# EasyEDA Pro project ProPrj_ADC前级驱动电路_2025-07-17.epro

# Schematic Schematic1
Board Name: Board1; Create Date: 2025-07-17; Page Name: P1; Project Name: ADC前级驱动电路; Schematic Name: Schematic1; Update Date: 2025-07-17; Company: 嘉立创EDA; Page Size: A4; Version: V1.0
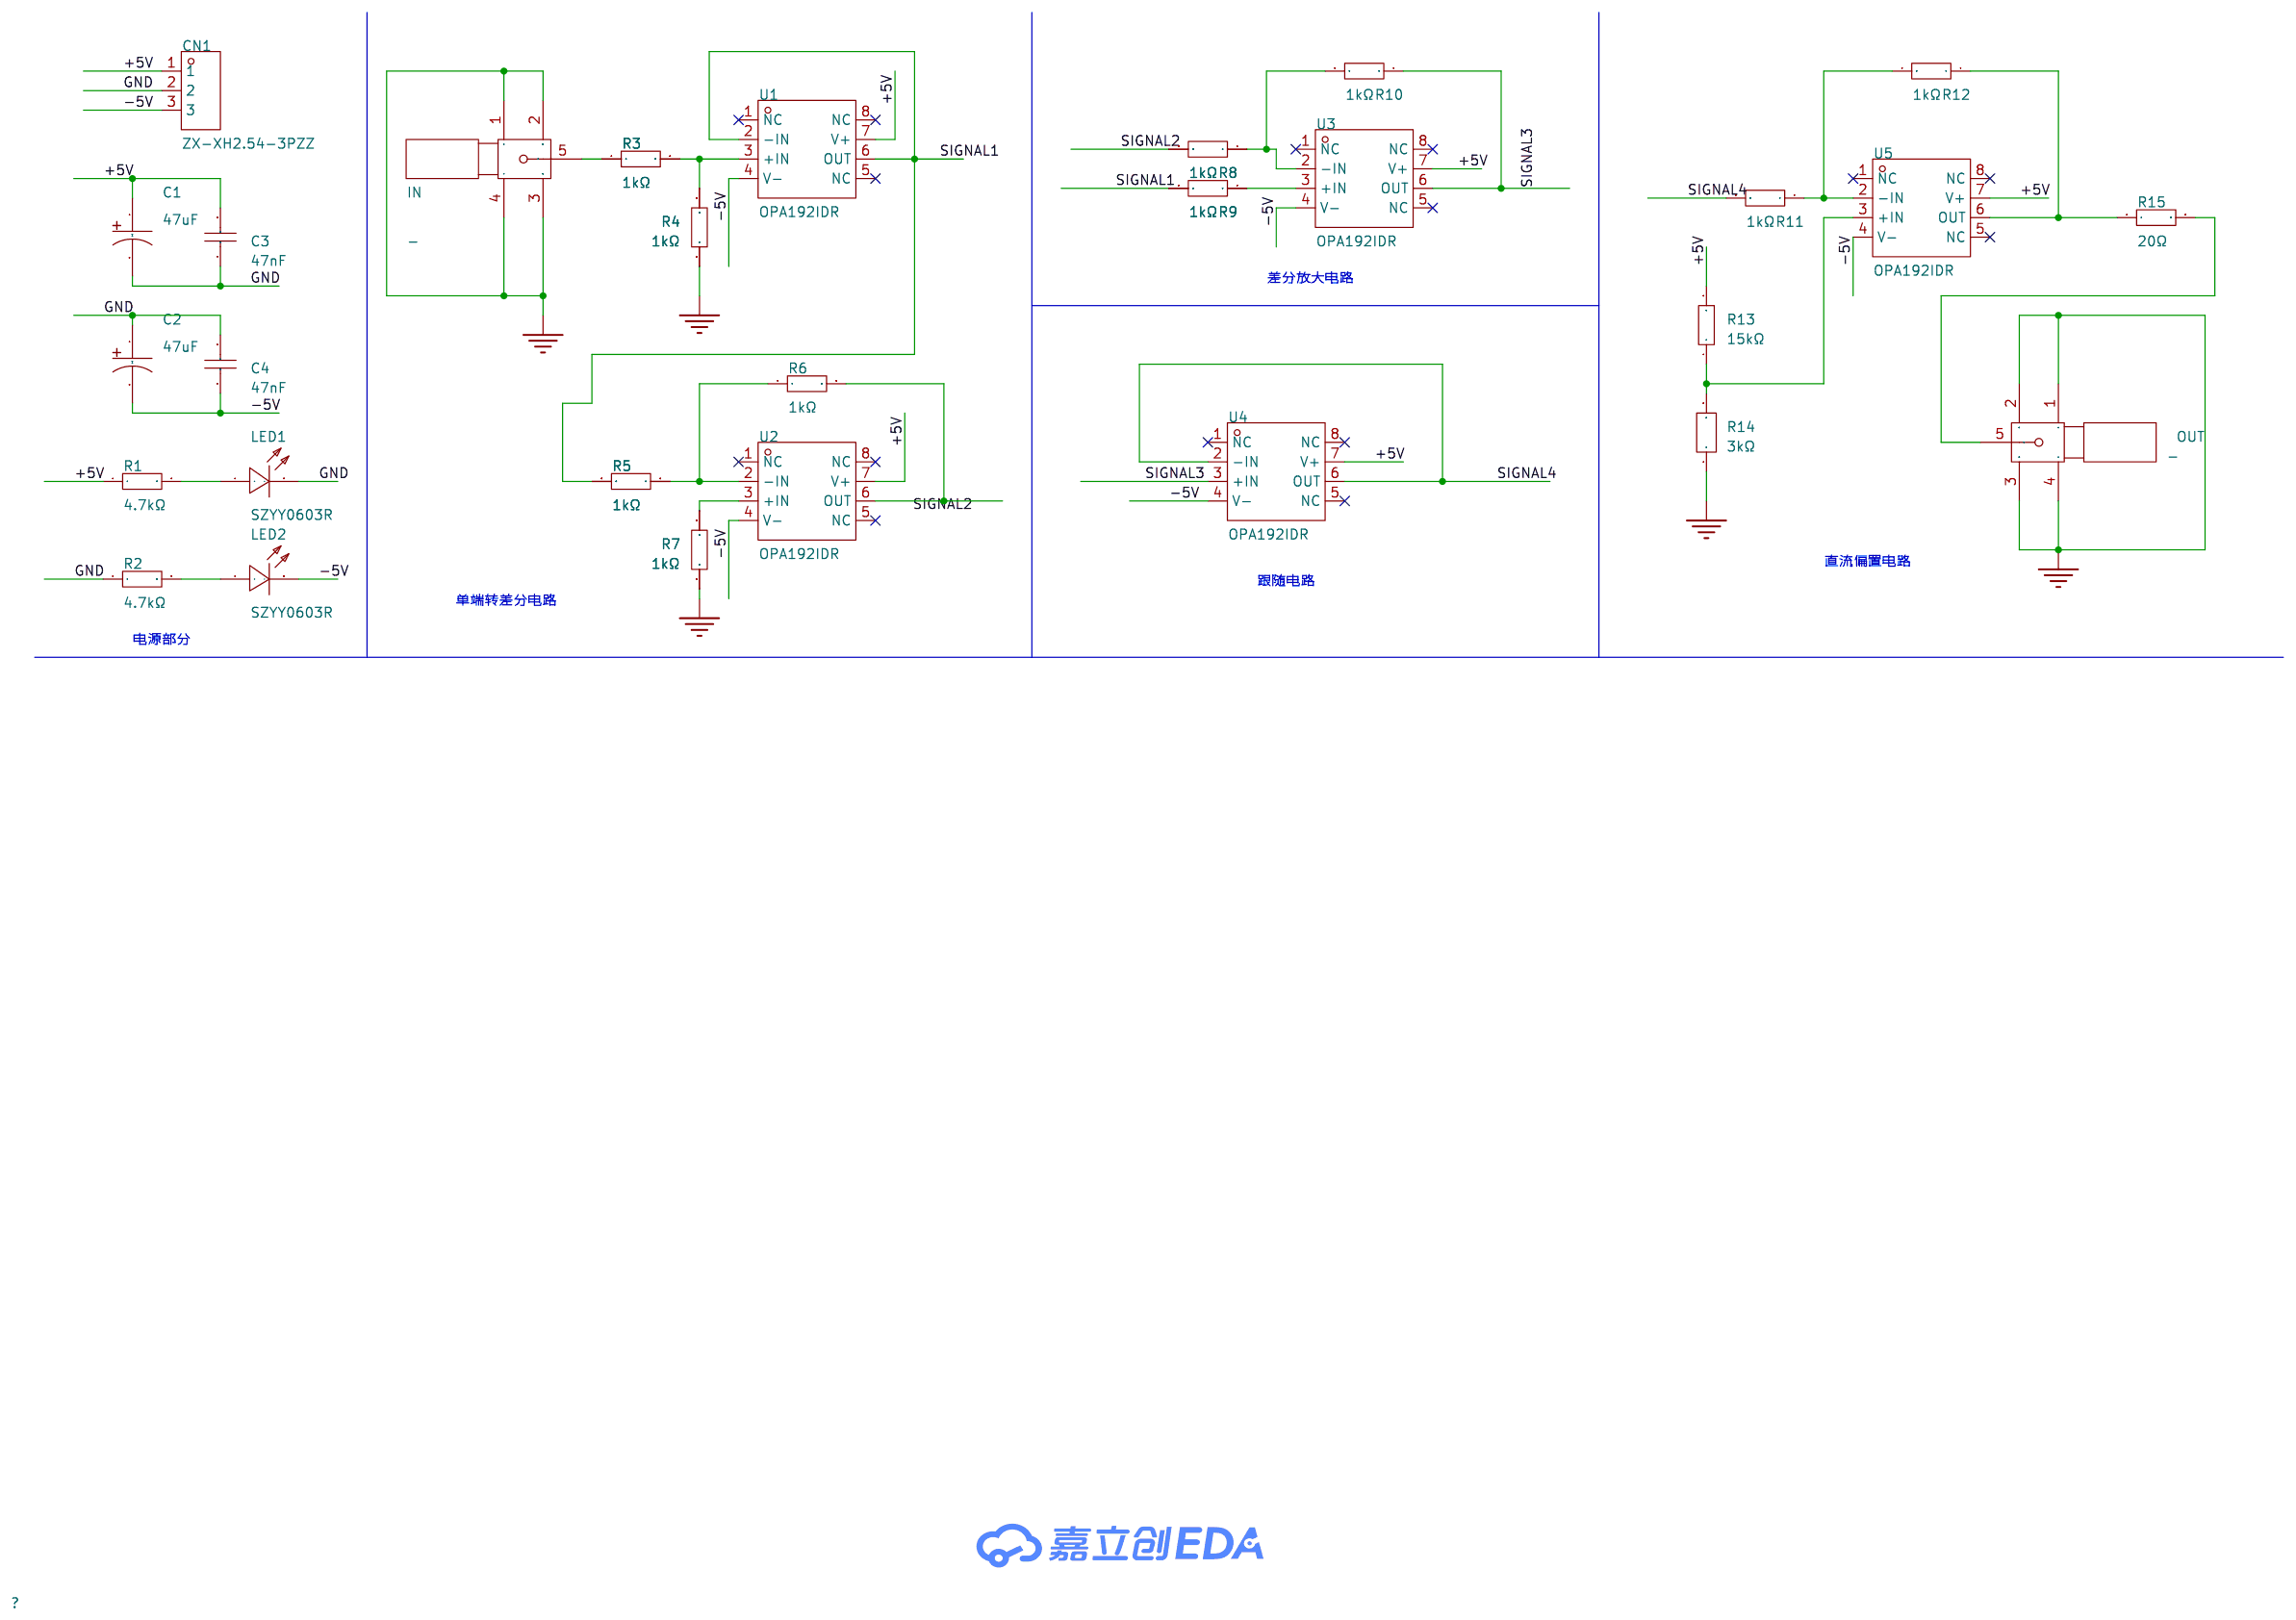
[diagram p0: schematic sheet]

## Parts
C1  47uF  [CAP-TH_BD5.0-P2.00-D0.8-FD]
C2  47uF  [CAP-TH_BD5.0-P2.00-D0.8-FD]
C3  47nF  [C0805]
C4  47nF  [C0805]
CN1  ZX-XH2.54-3PZZ  [CONN-TH_3P-P2.54_2501S-3P]
IN  -  [SMA-SMD_BWSMA-KE-P001]
LED1  SZYY0603R  [LED0603-R-RD]
LED2  SZYY0603R  [LED0603-R-RD]
OUT  -  [SMA-SMD_BWSMA-KE-P001]
R1  4.7kΩ  [R0805]
R2  4.7kΩ  [R0805]
R3  1kΩ  [R0805]
R4  1kΩ  [R0805]
R5  1kΩ  [R0805]
R6  1kΩ  [R0805]
R7  1kΩ  [R0805]
R8  1kΩ  [R0805]
R9  1kΩ  [R0805]
R10  1kΩ  [R0805]
R11  1kΩ  [R0805]
R12  1kΩ  [R0805]
R13  15kΩ  [R0805]
R14  3kΩ  [R0805]
R15  20Ω  [R0805]
U1  OPA192IDR  [SOIC-8_L4.9-W3.9-P1.27-LS6.0-BL]
U2  OPA192IDR  [SOIC-8_L4.9-W3.9-P1.27-LS6.0-BL]
U3  OPA192IDR  [SOIC-8_L4.9-W3.9-P1.27-LS6.0-BL]
U4  OPA192IDR  [SOIC-8_L4.9-W3.9-P1.27-LS6.0-BL]
U5  OPA192IDR  [SOIC-8_L4.9-W3.9-P1.27-LS6.0-BL]

## Library data of the parts
C1 C2 = NXB25V47M5*11 2.5TP: 容值:47uF;精度:±20%;额定电压:25V;纹波电流:250mA@100kHz;等效串联电阻(ESR):300mΩ@100kHz;; LCSC Part Name: 47uF ±20% 25V; Supplier Part: C371230; Manufacturer: SAMYOUNG(韩国三莹); Supplier Footprint: 插件,D5xL11mm; JLCPCB Part Class: 扩展库; Datasheet: https://atta.szlcsc.com/upload/public/pdf/source/20190227/C371244_FA85FFEFC2961227CF12E3CCE8C34A7D.pdf; Supplier: LCSC; Tolerance: ±20%; Voltage Rating: 25V; Ripple Current: 250mA@100kHz; Equivalent Series Resistance(ESR): 300mΩ@100kHz; Pin Spacing: 2mm; Diameter: 5mm; Height - Seated (Max): 11mm; Lifetime: 2000hrs@105℃; Operating Temperature: -40℃~+105℃
C3 C4 = CL21B473KBCNNNC: 容值:47nF;精度:±10%;额定电压:50V;材质(温度系数):X7R;; LCSC Part Name: 47nF ±10% 50V; Supplier Part: C53134; Manufacturer: SAMSUNG(三星); Supplier Footprint: 0805; JLCPCB Part Class: 基础库; Datasheet: https://atta.szlcsc.com/upload/public/pdf/source/20160218/1457707763339.pdf; Supplier: LCSC; Tolerance: ±10%; Voltage Rated: 50V; Temperature Coefficient: X7R
CN1 = ZX-XH2.54-3PZZ: 插针结构:1x3P;间距:2.5mm;安装方式:直插;参考系列:XH;总PIN数:3P;排数:1;每排PIN数:3;行距:-;额定电流:3A;触头材质:黄铜;触头镀层:锡;工作温度范围:-25℃~+85℃;; LCSC Part Name: 1x3P 间距:2.5mm 直插 系列:XH; Supplier Part: C7429633; Manufacturer: Megastar(兆星); Supplier Footprint: 插件,P=2.5mm; JLCPCB Part Class: 扩展库; Datasheet: https://atta.szlcsc.com/upload/public/pdf/source/20230619/AE17037A2CFDBE8D9CBA775D61AD0A84.pdf; Supplier: LCSC; Pins Structure: 1x3P; Pitch: 2.5mm; Mounting Type: 直插; Reference Series: XH; Number of Pins: 3P; Number of Rows: 1; Number of PINs Per Row: 3; Rated Current: 3A; Contact Material: 黄铜; Contact Plating: 锡; Operating Temperature: -25℃~+85℃; Rated Voltage (Max): 250V; Plastic Material: PA66; Flame Retardant Rating: UL94V-0; Color: 白色; Z-Height of the Board: 7mm; X-Length of Bottom Edge on Board (Spacing Line): 10mm; Y-Width of Bottom Edge on Board: 5.9mm
IN OUT = BWSMA-KE-P001: 连接器类型:板端;接口类型:内孔;端口数量:1;接口直径:5.2mm;接口长度/高度:-;频率:-;射频系列:SMA;阻抗:50Ω;样式:偏脚;工作温度:-;; LCSC Part Name: 内孔 SMA 偏脚; Supplier Part: C496550; Manufacturer: BAT WIRELESS(蝙蝠无线); Supplier Footprint: SMD; JLCPCB Part Class: 扩展库; Datasheet: https://atta.szlcsc.com/upload/public/pdf/source/20240320/28FD502871C976DFF213ABFCF2A0ED51.pdf; Supplier: LCSC; Connector Type: 板端; Interface: 内孔; Number of Ports: 1; Interface Diameter: 5.2mm; RF Series: SMA; Impedance: 50Ω; Style: 偏脚
LED1 LED2 = SZYY0603R: 发光颜色:红色;功率:40mW;正向电流:20mA;主波长:615nm~630nm;二极管配置:-;透镜颜色:无色透明透镜;色温:-;发光角度:120°;载带方式:-;工作温度:-40℃~+85℃;; LCSC Part Name: 红灯; Supplier Part: C434419; Manufacturer: yongyu(永裕光电); Supplier Footprint: 0603; JLCPCB Part Class: 扩展库; Datasheet: https://atta.szlcsc.com/upload/public/pdf/source/20191204/C434419_0B955C1F73FF88449D9A795B6FF49070.pdf; Supplier: LCSC; Emitted Color: 红色; Power Dissipation: 40mW; Forward Current: 20mA; Dominant Wavelength: 615nm~630nm; Peak Wavelength: 645nm; Lens Color: 无色透明透镜; Viewing Angle: 120°; Operating Temperature: -40℃~+85℃
R1 R2 = 0805W8F4701T5E: 电阻类型:厚膜电阻;阻值:4.7kΩ;精度:±1%;功率:125mW;最大工作电压:150V;温度系数:±100ppm/℃;; LCSC Part Name: 4.7kΩ ±1% 125mW 厚膜电阻; Supplier Part: C17673; Manufacturer: UNI-ROYAL(厚声); Supplier Footprint: 0805; JLCPCB Part Class: 基础库; Datasheet: https://atta.szlcsc.com/upload/public/pdf/source/20200306/C422600_1E6D84923E4A46A82E41ADD87F860B5C.pdf; Supplier: LCSC; Type: 厚膜电阻; Tolerance: ±1%; Power(Watts): 125mW; Overload Voltage (Max): 150V; Temperature Coefficient: ±100ppm/℃; Operating Temperature Range: -55℃~+155℃
R3-R12 = 0805W8F1001T5E: 电阻类型:厚膜电阻;阻值:1kΩ;精度:±1%;功率:125mW;最大工作电压:150V;温度系数:±100ppm/℃;; LCSC Part Name: 1kΩ ±1% 125mW 厚膜电阻; Supplier Part: C17513; Manufacturer: UNI-ROYAL(厚声); Supplier Footprint: 0805; JLCPCB Part Class: 基础库; Datasheet: https://atta.szlcsc.com/upload/public/pdf/source/20200306/C422600_1E6D84923E4A46A82E41ADD87F860B5C.pdf; Supplier: LCSC; Type: 厚膜电阻; Tolerance: ±1%; Power(Watts): 125mW; Overload Voltage (Max): 150V; Temperature Coefficient: ±100ppm/℃; Operating Temperature Range: -55℃~+155℃
R13 = 0805W8F1502T5E: 电阻类型:厚膜电阻;阻值:15kΩ;精度:±1%;功率:125mW;最大工作电压:150V;温度系数:±100ppm/℃;; LCSC Part Name: 15kΩ ±1% 125mW 厚膜电阻; Supplier Part: C17475; Manufacturer: UNI-ROYAL(厚声); Supplier Footprint: 0805; JLCPCB Part Class: 基础库; Datasheet: https://atta.szlcsc.com/upload/public/pdf/source/20200306/C422600_1E6D84923E4A46A82E41ADD87F860B5C.pdf; Supplier: LCSC; Type: 厚膜电阻; Tolerance: ±1%; Power(Watts): 125mW; Overload Voltage (Max): 150V; Temperature Coefficient: ±100ppm/℃; Operating Temperature Range: -55℃~+155℃
R14 = FRC0805J302 TS: 电阻类型:厚膜电阻;阻值:3kΩ;精度:±5%;功率:125mW;最大工作电压:150V;温度系数:±100ppm/℃;; LCSC Part Name: 3kΩ ±5% 125mW 厚膜电阻; Supplier Part: C2907324; Manufacturer: FOJAN(富捷); Supplier Footprint: 0805; JLCPCB Part Class: 扩展库; Datasheet: https://atta.szlcsc.com/upload/public/pdf/source/20211221/925EC7D7225764EE0046F22065062C87.pdf; Supplier: LCSC; Type: 厚膜电阻; Tolerance: ±5%; Power(Watts): 125mW; Overload Voltage (Max): 150V; Temperature Coefficient: ±100ppm/℃; Operating Temperature Range: -55℃~+155℃
R15 = 0805W8F200JT5E: 电阻类型:厚膜电阻;阻值:20Ω;精度:±1%;功率:125mW;最大工作电压:150V;温度系数:±200ppm/℃;; LCSC Part Name: 20Ω ±1% 125mW 厚膜电阻; Supplier Part: C17544; Manufacturer: UNI-ROYAL(厚声); Supplier Footprint: 0805; JLCPCB Part Class: 基础库; Datasheet: https://atta.szlcsc.com/upload/public/pdf/source/20200306/C422600_1E6D84923E4A46A82E41ADD87F860B5C.pdf; Supplier: LCSC; Type: 厚膜电阻; Tolerance: ±1%; Power(Watts): 125mW; Overload Voltage (Max): 150V; Temperature Coefficient: ±200ppm/℃; Operating Temperature Range: -55℃~+155℃
U1-U5 = OPA192IDR: 放大器数:单路;增益带宽积(GBP):10MHz;输入偏置电流(Ib):5pA;输入失调电压(Vos):5uV;压摆率(SR):20V/us;轨到轨:轨到轨输入,轨到轨输出;; Supplier Part: C2861286; Manufacturer: TI(德州仪器); Supplier Footprint: SOIC-8; JLCPCB Part Class: 扩展库; Datasheet: https://www.ti.com/cn/lit/gpn/opa4192; Supplier: LCSC; Number of Channels: 单路; Gain Bandwidth Product: 10MHz; Ib - Input Bias Current: 5pA; Vos - Input Offset Voltage: 5uV; Common Mode Rejection Ratio(CMRR): 140dB; Slew Rate: 20V/us; Output Current: 65mA; Rail to Rail: 轨到轨输入,轨到轨输出; Input Offset Voltage Drift(Vos TC): 200nV/℃; Quiescent Current(Iq): 1mA; Operating Temperature: -40℃~+125℃; Single Supply: 4.5V~36V; Dual Supply: -18V~-2.25V；2.25V~18V; Maximum Power Supply Range (Vdd-Vss): 36V; Noise density(eN): 5.5nV/√Hz@1kHz; Input Offset Current(Ios): 2pA

## Nets
+5V: C1.1 C3.2 CN1.1 R1.1 R13.2 U1.7(V+) U2.7(V+) U3.7(V+) U4.7(V+) U5.7(V+)
-5V: C2.2 C4.1 CN1.3 LED2.2(-) U1.4(V-) U2.4(V-) U3.4(V-) U4.4(V-) U5.4(V-)
GND: C1.2 C2.1 C3.1 C4.2 CN1.2 IN.1 IN.2 IN.3 IN.4 LED1.2(-) OUT.1 OUT.2 OUT.3 OUT.4 R2.1 R4.1 R7.1 R14.1
SIGNAL1: R5.2 R9.2 U1.2(-IN) U1.6(OUT)
SIGNAL2: R6.2 R8.2 U2.6(OUT)
SIGNAL3: R10.1 U3.6(OUT) U4.3(+IN)
SIGNAL4: R11.2 U4.2(-IN) U4.6(OUT)
$1N2910: IN.5 R3.1
$1N2927: LED1.1(+) R1.2
$1N2936: LED2.1(+) R2.2
$1N3121: R3.2 R4.2 U1.3(+IN)
$1N3311: R7.2 U2.3(+IN)
$1N3355: R5.1 R6.1 U2.2(-IN)
$1N3535: R8.1 R10.2 U3.2(-IN)
$1N3541: R9.1 U3.3(+IN)
$1N3767: R11.1 R12.2 U5.2(-IN)
$1N3921: R13.1 R14.2 U5.3(+IN)
$1N4048: OUT.5 R15.2
$1N4065: R12.1 R15.1 U5.6(OUT)

Not connected (* = marked no-connect by the designer): U1 1(NC)* 5(NC)* 8(NC)*; U2 1(NC)* 5(NC)* 8(NC)*; U3 1(NC)* 5(NC)* 8(NC)*; U4 1(NC)* 5(NC)* 8(NC)*; U5 1(NC)* 5(NC)* 8(NC)*

## Notes on the sheet
- 差分放大电路
- 直流偏置电路
- 跟随电路
- 单端转差分电路
- 电源部分

# Board PCB1
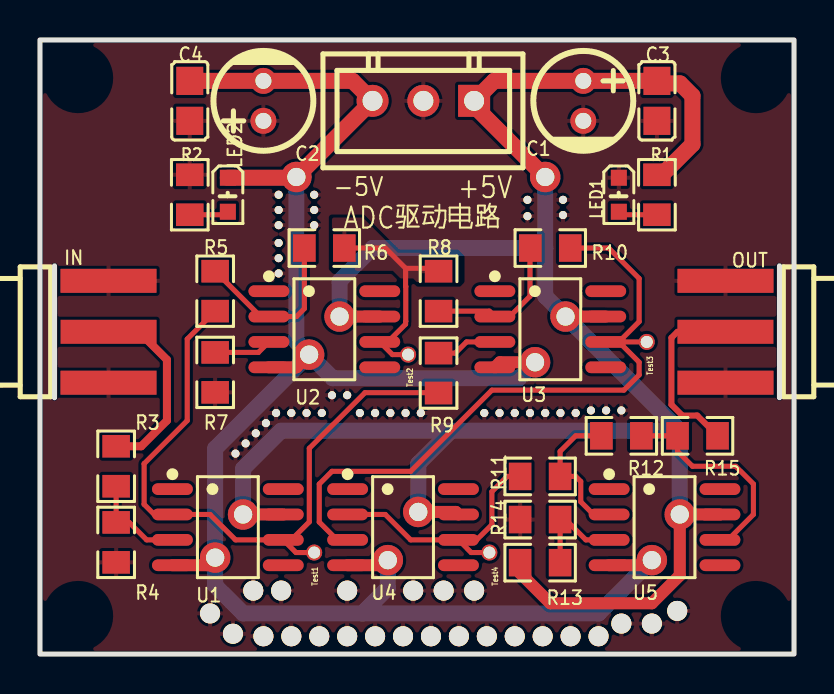
[diagram p1: board, top side]
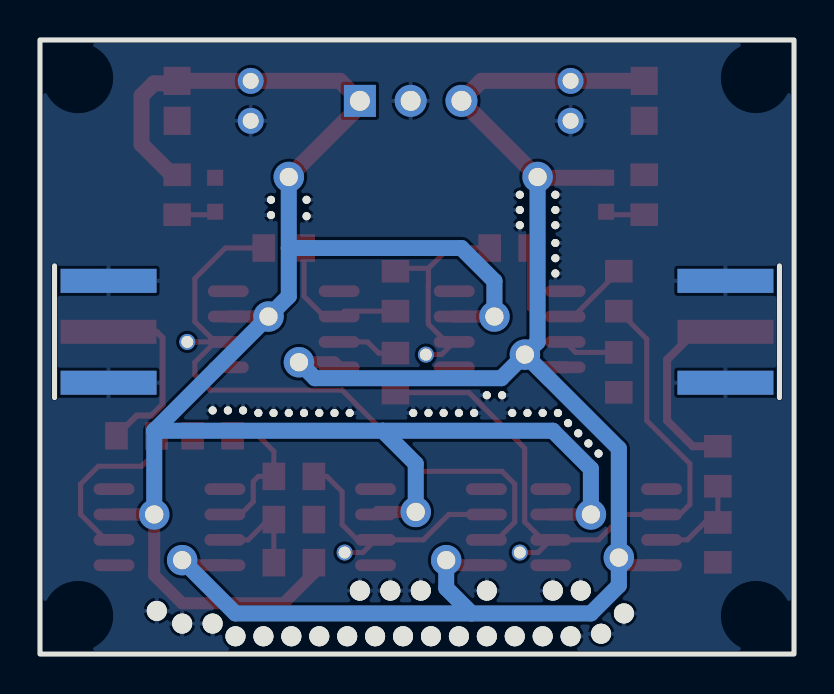
[diagram p2: board, bottom side, seen from below]

Outline 37.72 x 30.73 mm; copper layers: Top Layer, Bottom Layer. Coordinates in mm from the lower left corner of the outline.
Outline path: rectangle 0,30.73 37.72,0
Stack: Top Layer 0.035mm / Dielectric1 1.51mm FR4 er 4.5 / Bottom Layer 0.035mm

## Design rules (mm)
template: JLCPCB Capability(Two Layers Board)
spacing copperThickness1oz (default): track to track 0.102, other pairs 0.152 to 0.3
spacing copperThickness2oz: track to track 0.203, other pairs 0.152 to 0.3
track width copperThickness1oz (default): min 0.127, default 0.254, max 2.54
track width copperThickness2oz: min 0.203, default 0.254, max 2.54
differential pair differentialPair (default): width min 0.127, default 0.254, max 2.54; gap min 0.152, default 0.152
via viaSize (default): diameter min 0.5, default 0.61, max 10; hole min 0.3, default 0.305, max 6.3

## Placement (name value [footprint] x y rotation side)
-5V  ZX-XH2.54-3PZZ  [CONN-TH_3P-P2.54_2501S-3P]  19.18 27.69 180 top
C1  47uF  [CAP-TH_BD5.0-P2.00-D0.8-FD]  27.18 27.69 270 top
C2  47uF  [CAP-TH_BD5.0-P2.00-D0.8-FD]  11.18 27.69 90 top
C3  47nF  [C0805]  30.86 27.69 90 top
C4  47nF  [C0805]  7.49 27.69 270 top
IN  -  [SMA-SMD_BWSMA-KE-P001]  3.43 16.13 180 top
LED1  SZYY0603R  [LED0603-R-RD]  28.96 22.99 270 top
LED2  SZYY0603R  [LED0603-R-RD]  9.4 22.99 270 top
NOREF  -  [Pad_e364]  13.34 12.06 0 top
NOREF#2  -  [Pad_e334]  18.16 0.89 0 top
NOREF#3  -  [Pad_e393]  24.38 22.73 0 top
NOREF#4  -  [Pad_e342]  29.08 1.52 0 top
NOREF#5  -  [Pad_e389]  11.94 21.46 0 top
NOREF#6  -  [Pad_e336]  20.95 0.89 0 top
NOREF#7  -  [Pad_e351]  21.72 3.17 0 top
NOREF#8  -  [Pad_e273]  26.29 16.89 0 top
NOREF#9  -  [Pad_e60]  25.27 23.88 0 top
NOREF#10  -  [Pad_e357]  9.78 10.03 0 top
NOREF#11  -  [Pad_e360]  10.79 11.05 0 top
NOREF#12  -  [Pad_e397]  18.41 14.99 0 top
NOREF#13  -  [Pad_e333]  16.76 0.89 0 top
NOREF#14  -  [Pad_e335]  19.56 0.89 0 top
NOREF#15  -  [Pad_e330]  12.57 0.89 0 top
NOREF#16  -  [Pad_e376]  23.75 12.06 0 top
NOREF#17  -  [Pad_e340]  26.54 0.89 0 top
NOREF#18  -  [Pad_e329]  11.18 0.89 0 top
NOREF#19  -  [Pad_e394]  24.38 21.91 0 top
NOREF#20  -  [Pad_e346]  12.06 3.17 0 top
NOREF#21  -  [Pad_e341]  27.94 0.89 0 top
NOREF#22  -  [Pad_e298]  10.16 6.98 0 top
NOREF#23  -  [Pad_e377]  24.51 12.06 0 top
NOREF#24  -  [Pad_e339]  25.15 0.89 0 top
NOREF#25  -  [Pad_e392]  11.94 19.05 0 top
NOREF#26  -  [Pad_e387]  11.94 22.99 0 top
NOREF#27  -  [Pad_e246]  17.4 4.7 0 top
NOREF#28  -  [Pad_e383]  29.08 12.19 0 top
NOREF#29  -  [Pad_e41]  12.83 23.88 0 top
NOREF#30  -  [Pad_e386]  13.72 21.46 0 top
NOREF#31  -  [Pad_e264]  30.61 4.7 0 top
NOREF#32  -  [Pad_e380]  26.8 12.06 0 top
NOREF#33  -  [Pad_e388]  11.94 22.22 0 top
NOREF#34  -  [Pad_e227]  8.76 4.83 0 top
NOREF#35  -  [Pad_e396]  26.16 21.97 0 top
NOREF#36  -  [Pad_e337]  22.35 0.89 0 top
NOREF#37  -  [Pad_e359]  10.29 10.54 0 top
NOREF#38  -  [Pad_e390]  11.94 20.57 0 top
NOREF#39  -  [Pad_e222]  13.46 14.99 0 top
NOREF#40  -  [Pad_e362]  11.81 12.06 0 top
NOREF#41  -  [Pad_e366]  14.6 12.95 0 top
NOREF#42  -  [Pad_e413]  22.48 5.08 0 top
NOREF#43  -  [Pad_e361]  11.3 11.56 0 top
NOREF#44  -  [Pad_e395]  26.16 22.73 0 top
NOREF#45  -  [Pad_e363]  12.57 12.06 0 top
NOREF#46  -  [Pad_e375]  22.99 12.06 0 top
NOREF#47  -  [Pad_e414]  30.35 15.62 0 top
NOREF#48  -  [Pad_e372]  19.05 12.06 0 top
NOREF#49  -  [Pad_e412]  13.72 5.08 0 top
NOREF#50  -  [Pad_e378]  25.27 12.06 0 top
NOREF#51  -  [Pad_e343]  30.61 1.52 0 top
NOREF#52  -  [Pad_e331]  13.97 0.89 0 top
NOREF#53  -  [Pad_e365]  14.1 12.06 0 top
NOREF#54  -  [Pad_e349]  18.67 3.17 0 top
NOREF#55  -  [Pad_e391]  11.94 19.81 0 top
NOREF#56  -  [Pad_e381]  27.56 12.19 0 top
NOREF#57  -  [Pad_e345]  10.67 3.17 0 top
NOREF#58  -  [Pad_e385]  13.72 22.22 0 top
NOREF#59  -  [Pad_e241]  14.99 16.89 0 top
NOREF#60  -  [Pad_e338]  23.75 0.89 0 top
NOREF#61  -  [Pad_e369]  16.76 12.06 0 top
NOREF#62  -  [Pad_e344]  31.88 2.16 0 top
NOREF#63  -  [Pad_e370]  17.53 12.06 0 top
NOREF#64  -  [Pad_e384]  13.72 22.99 0 top
NOREF#65  -  [Pad_e350]  20.19 3.17 0 top
NOREF#66  -  [Pad_e373]  22.22 12.06 0 top
NOREF#67  -  [Pad_e348]  15.37 3.17 0 top
NOREF#68  -  [Pad_e294]  18.92 7.11 0 top
NOREF#69  -  [Pad_e332]  15.37 0.89 0 top
NOREF#70  -  [Pad_e267]  24.76 14.6 0 top
NOREF#71  -  [Pad_e379]  26.03 12.06 0 top
NOREF#72  -  [Pad_e367]  15.37 12.95 0 top
NOREF#73  -  [Pad_e328]  9.65 1.02 0 top
NOREF#74  -  [Pad_e325]  8.51 2.03 0 top
NOREF#75  -  [Pad_e382]  28.32 12.19 0 top
NOREF#76  -  [Pad_e368]  16 12.06 0 top
NOREF#77  -  [Pad_e291]  32 6.98 0 top
NOREF#78  -  [Pad_e371]  18.29 12.06 0 top
OUT  -  [SMA-SMD_BWSMA-KE-P001]  34.29 16.13 0 top
R1  4.7kΩ  [R0805]  30.86 22.99 270 top
R2  4.7kΩ  [R0805]  7.49 22.99 270 top
R3  1kΩ  [R0805]  3.81 9.4 270 top
R4  1kΩ  [R0805]  3.81 5.59 90 top
R5  1kΩ  [R0805]  8.76 18.16 270 top
R6  1kΩ  [R0805]  14.22 20.32 0 top
R7  1kΩ  [R0805]  8.76 14.1 90 top
R8  1kΩ  [R0805]  19.94 18.16 90 top
R9  1kΩ  [R0805]  19.94 14.06 270 top
R10  1kΩ  [R0805]  25.53 20.32 180 top
R11  1kΩ  [R0805]  25.02 8.89 180 top
R12  1kΩ  [R0805]  29.08 10.92 180 top
R13  15kΩ  [R0805]  25.02 4.57 180 top
R14  3kΩ  [R0805]  25.02 6.73 0 top
R15  20Ω  [R0805]  32.89 10.92 0 top
U1  OPA192IDR  [SOIC-8_L4.9-W3.9-P1.27-LS6.0-BL]  9.4 6.35 270 top
U2  OPA192IDR  [SOIC-8_L4.9-W3.9-P1.27-LS6.0-BL]  14.22 16.26 270 top
U3  OPA192IDR  [SOIC-8_L4.9-W3.9-P1.27-LS6.0-BL]  25.53 16.26 270 top
U4  OPA192IDR  [SOIC-8_L4.9-W3.9-P1.27-LS6.0-BL]  18.16 6.35 270 top
U5  OPA192IDR  [SOIC-8_L4.9-W3.9-P1.27-LS6.0-BL]  31.24 6.35 270 top

## Footprints (pads in the part's own frame, mm; a bottom-side part is the same pattern mirrored in y, then rotated)
C0805
  rect 1.41x1.35 smd: 1(-1,0) 2(1,0)
CAP-TH_BD5.0-P2.00-D0.8-FD
  round 1.3 hole 0.8: 1(-1,0) 2(1,0)
CONN-TH_3P-P2.54_2501S-3P
  rect 1.6x1.6 hole 1: 1(-2.54,0)
  round 1.6 hole 1: 2(0,0) 3(2.54,0)
LED0603-R-RD
  rect 0.8x0.8 smd: 1(0.851,0) 2(-0.851,0)
Pad_e41
  round 1.524 hole 0.914: 1(0,0)
Pad_e60
  round 1.524 hole 0.914: 1(0,0)
Pad_e222
  round 1.524 hole 0.914: 1(0,0)
Pad_e227
  round 1.524 hole 0.914: 1(0,0)
Pad_e241
  round 1.524 hole 0.914: 1(0,0)
Pad_e246
  round 1.524 hole 0.914: 1(0,0)
Pad_e264
  round 1.524 hole 0.914: 1(0,0)
Pad_e267
  round 1.524 hole 0.914: 1(0,0)
Pad_e273
  round 1.524 hole 0.914: 1(0,0)
Pad_e291
  round 1.524 hole 0.914: 1(0,0)
Pad_e294
  round 1.524 hole 0.914: 1(0,0)
Pad_e298
  round 1.524 hole 0.914: 1(0,0)
Pad_e325
  round 1 hole 1: 1(0,0)
Pad_e328
  round 1 hole 1: 1(0,0)
Pad_e329
  round 1 hole 1: 1(0,0)
Pad_e330
  round 1 hole 1: 1(0,0)
Pad_e331
  round 1 hole 1: 1(0,0)
Pad_e332
  round 1 hole 1: 1(0,0)
Pad_e333
  round 1 hole 1: 1(0,0)
Pad_e334
  round 1 hole 1: 1(0,0)
Pad_e335
  round 1 hole 1: 1(0,0)
Pad_e336
  round 1 hole 1: 1(0,0)
Pad_e337
  round 1 hole 1: 1(0,0)
Pad_e338
  round 1 hole 1: 1(0,0)
Pad_e339
  round 1 hole 1: 1(0,0)
Pad_e340
  round 1 hole 1: 1(0,0)
Pad_e341
  round 1 hole 1: 1(0,0)
Pad_e342
  round 1 hole 1: 1(0,0)
Pad_e343
  round 1 hole 1: 1(0,0)
Pad_e344
  round 1 hole 1: 1(0,0)
Pad_e345
  round 1 hole 1: 1(0,0)
Pad_e346
  round 1 hole 1: 1(0,0)
Pad_e348
  round 1 hole 1: 1(0,0)
Pad_e349
  round 1 hole 1: 1(0,0)
Pad_e350
  round 1 hole 1: 1(0,0)
Pad_e351
  round 1 hole 1: 1(0,0)
Pad_e357
  round 0.4 hole 0.5x0.4: 1(0,0)
Pad_e359
  round 0.4 hole 0.4: 1(0,0)
Pad_e360
  round 0.4 hole 0.4: 1(0,0)
Pad_e361
  round 0.4 hole 0.4: 1(0,0)
Pad_e362
  round 0.4 hole 0.4: 1(0,0)
Pad_e363
  round 0.4 hole 0.4: 1(0,0)
Pad_e364
  round 0.4 hole 0.4: 1(0,0)
Pad_e365
  round 0.4 hole 0.4: 1(0,0)
Pad_e366
  round 0.4 hole 0.4: 1(0,0)
Pad_e367
  round 0.4 hole 0.4: 1(0,0)
Pad_e368
  round 0.4 hole 0.4: 1(0,0)
Pad_e369
  round 0.4 hole 0.4: 1(0,0)
Pad_e370
  round 0.4 hole 0.4: 1(0,0)
Pad_e371
  round 0.4 hole 0.4: 1(0,0)
Pad_e372
  round 0.4 hole 0.4: 1(0,0)
Pad_e373
  round 0.4 hole 0.4: 1(0,0)
Pad_e375
  round 0.4 hole 0.4: 1(0,0)
Pad_e376
  round 0.4 hole 0.4: 1(0,0)
Pad_e377
  round 0.4 hole 0.4: 1(0,0)
Pad_e378
  round 0.4 hole 0.4: 1(0,0)
Pad_e379
  round 0.4 hole 0.4: 1(0,0)
Pad_e380
  round 0.4 hole 0.4: 1(0,0)
Pad_e381
  round 0.4 hole 0.4: 1(0,0)
Pad_e382
  round 0.4 hole 0.4: 1(0,0)
Pad_e383
  round 0.4 hole 0.4: 1(0,0)
Pad_e384
  round 0.4 hole 0.4: 1(0,0)
Pad_e385
  round 0.4 hole 0.4: 1(0,0)
Pad_e386
  round 0.4 hole 0.4: 1(0,0)
Pad_e387
  round 0.4 hole 0.4: 1(0,0)
Pad_e388
  round 0.4 hole 0.4: 1(0,0)
Pad_e389
  round 0.4 hole 0.4: 1(0,0)
Pad_e390
  round 0.4 hole 0.4: 1(0,0)
Pad_e391
  round 0.4 hole 0.4: 1(0,0)
Pad_e392
  round 0.4 hole 0.4: 1(0,0)
Pad_e393
  round 0.4 hole 0.4: 1(0,0)
Pad_e394
  round 0.4 hole 0.4: 1(0,0)
Pad_e395
  round 0.4 hole 0.4: 1(0,0)
Pad_e396
  round 0.4 hole 0.4: 1(0,0)
Pad_e397
  round 0.8 hole 0.6: 1(0,0)
Pad_e412
  round 0.8 hole 0.6: 1(0,0)
Pad_e413
  round 0.8 hole 0.6: 1(0,0)
Pad_e414
  round 0.8 hole 0.6: 1(0,0)
R0805
  rect 1.133x1.377 smd: 1(-1,0) 2(1,0)
SMA-SMD_BWSMA-KE-P001
  rect 4.8x1.2 smd: 1(0,-2.55) 2(0,2.55) 5(0,0)
  rect 4.8x1.2 smd far side: 3(0,2.55) 4(0,-2.55)
SOIC-8_L4.9-W3.9-P1.27-LS6.0-BL
  oval 0.588x2.045 smd: 1(-1.905,-2.772) 2(-0.635,-2.772) 3(0.635,-2.772) 4(1.905,-2.772) 5(1.905,2.772) 6(0.635,2.772) 7(-0.635,2.772) 8(-1.905,2.772)

## Nets
+5V: -5V.1 C1.1 C3.2 NOREF#8.1 NOREF#9.1 NOREF#22.1 NOREF#59.1 NOREF#68.1 NOREF#77.1 R1.1 R13.2 U1.7 U2.7 U3.7 U4.7 U5.7
-5V: -5V.3 C2.2 C4.1 LED2.2 NOREF#27.1 NOREF#29.1 NOREF#31.1 NOREF#34.1 NOREF#39.1 NOREF#70.1 U1.4 U2.4 U3.4 U4.4 U5.4
GND: -5V.2 C1.2 C2.1 C3.1 C4.2 IN.1 IN.2 IN.3 IN.4 LED1.2 NOREF.1 NOREF#2.1 NOREF#3.1 NOREF#4.1 NOREF#5.1 NOREF#6.1 NOREF#7.1 NOREF#10.1 NOREF#11.1 NOREF#13.1 NOREF#14.1 NOREF#15.1 NOREF#16.1 NOREF#17.1 NOREF#18.1 NOREF#19.1 NOREF#20.1 NOREF#21.1 NOREF#23.1 NOREF#24.1 NOREF#25.1 NOREF#26.1 NOREF#28.1 NOREF#30.1 NOREF#32.1 NOREF#33.1 NOREF#35.1 NOREF#36.1 NOREF#37.1 NOREF#38.1 NOREF#40.1 NOREF#41.1 NOREF#43.1 NOREF#44.1 NOREF#45.1 NOREF#46.1 NOREF#48.1 NOREF#50.1 NOREF#51.1 NOREF#52.1 NOREF#53.1 NOREF#54.1 NOREF#55.1 NOREF#56.1 NOREF#57.1 NOREF#58.1 NOREF#60.1 NOREF#61.1 NOREF#62.1 NOREF#63.1 NOREF#64.1 NOREF#65.1 NOREF#66.1 NOREF#67.1 NOREF#69.1 NOREF#71.1 NOREF#72.1 NOREF#73.1 NOREF#74.1 NOREF#75.1 NOREF#76.1 NOREF#78.1 OUT.1 OUT.2 OUT.3 OUT.4 R2.1 R4.1 R7.1 R14.1
SIGNAL1: NOREF#49.1 R5.2 R9.2 U1.2 U1.6
SIGNAL2: NOREF#12.1 R6.2 R8.2 U2.6
SIGNAL3: NOREF#47.1 R10.1 U3.6 U4.3
SIGNAL4: NOREF#42.1 R11.2 U4.2 U4.6
$1N2910: IN.5 R3.1
$1N2927: LED1.1 R1.2
$1N2936: LED2.1 R2.2
$1N3121: R3.2 R4.2 U1.3
$1N3311: R7.2 U2.3
$1N3355: R5.1 R6.1 U2.2
$1N3535: R8.1 R10.2 U3.2
$1N3541: R9.1 U3.3
$1N3767: R11.1 R12.2 U5.2
$1N3921: R13.1 R14.2 U5.3
$1N4048: OUT.5 R15.2
$1N4065: R12.1 R15.1 U5.6

Pads without a net: U1 1 5 8; U2 1 5 8; U3 1 5 8; U4 1 5 8; U5 1 5 8

## Routing (per net, layer and track width the routed paths; a pad name or vN(x,y) marks a point on that pad's centre or on a via; arc(x,y) is an arc through that point)
+5V: length 106.7
  Top Layer w0.6: NOREF#68.1 20.81,7.11 U4.7 ; R13.2 24.02,4.05 25.53,2.54 30.61,2.54 32,3.94 NOREF#77.1 U5.7 ; NOREF#22.1 U1.7 ; NOREF#8.1 28.3,16.89 ; NOREF#59.1 17,16.89
  Top Layer w0.8: NOREF#9.1 21.72,27.43 -5V.1 22.72,28.69 C1.1 C3.2 30.99,28.56 32.02,28.56 32.64,27.94 32.64,25.51 31.12,23.99 R1.1
  Bottom Layer w0.8: 32,11.18 NOREF#8.1 25.27,17.91 NOREF#9.1 ; 32,11.18 NOREF#77.1 ; 32,11.18 20.57,11.18 ; 20.57,11.18 18.92,9.52 NOREF#68.1 ; 20.57,11.18 12.06,11.18 10.16,9.27 NOREF#22.1 ; NOREF#59.1 14.99,18.67 16.64,20.32 25.27,20.32
-5V: length 90.9
  Top Layer w0.6: NOREF#34.1 8.38,4.44 U1.4 ; U4.4 17.15,4.44 NOREF#27.1 ; U3.4 23.01,14.6 NOREF#70.1 ; NOREF#31.1 30.35,4.44 U5.4 ; U2.4 12.83,14.35 NOREF#39.1
  Top Layer w0.8: LED2.2 12.79,23.84 -5V.3 15.64,28.69 C2.2 C4.1
  Bottom Layer w0.8: NOREF#39.1 8.76,10.29 NOREF#34.1 8.76,3.43 10.16,2.03 16.13,2.03 ; NOREF#39.1 14.64,13.8 23.97,13.8 NOREF#70.1 ; NOREF#39.1 12.83,15.62 NOREF#29.1 ; 16.13,2.03 17.4,3.3 NOREF#27.1 ; 16.13,2.03 27.94,2.03 NOREF#31.1
SIGNAL1: length 33.6
  Top Layer w0.254: U1.6 9.78,5.71 8.51,6.98 U1.2 5.72,6.98 5.21,7.49 5.21,9.52 7.37,11.68 7.37,15.76 R5.2 ; U1.6 12.57,5.71 13.47,6.61 13.47,10.3 16.26,13.08 19.92,13.08 R9.2 ; U1.6 12.81,5.08 NOREF#49.1
SIGNAL2: length 11.3
  Top Layer w0.254: R8.2 19.8,19.3 18.29,19.3 ; NOREF#12.1 17.63,14.99 U2.6 17.4,15.62 18.29,16.51 18.29,16.64 18.3,16.65 18.3,18.4 18.29,18.41 18.29,19.3 ; 18.29,19.3 17.27,20.32 R6.2
SIGNAL3: length 33.8
  Top Layer w0.254: 28.96,15.62 29.97,16.64 29.97,18.8 28.45,20.32 R10.1 ; 28.96,15.62 U3.6 ; 28.96,15.62 NOREF#47.1 ; 28.96,15.62 29.97,14.6 29.97,13.97 29.21,13.21 22.61,13.21 18.54,9.14 14.6,9.14 13.97,8.51 13.97,6.6 14.86,5.71 U4.3
SIGNAL4: length 13.2
  Top Layer w0.254: U4.6 21.57,5.08 NOREF#42.1 ; U4.6 21.84,5.71 22.61,6.48 22.61,8.13 23.37,8.89 R11.2 ; U4.6 18.54,5.71 17.27,6.98 U4.2
$1N2910: length 9.5
  Top Layer w0.4: 3.56,16.13 4.95,16.13 6.35,14.73 6.35,11.68 5.06,10.4 R3.1
$1N2927: length 2
  Top Layer w0.254: LED1.1 29.1,21.99 R1.2
$1N2936: length 2
  Top Layer w0.254: LED2.1 9.25,21.99 R2.2
$1N3121: length 5
  Top Layer w0.254: R3.2 R4.2 4.46,6.59 5.33,5.71 U1.3
$1N3311: length 2.9
  Top Layer w0.254: U2.3 10.93,15.1 R7.2
$1N3355: length 8.6
  Top Layer w0.254: R5.1 11.03,16.89 12.83,16.89 13.22,17.29 R6.1
$1N3535: length 7.5
  Top Layer w0.254: R10.2 24.51,20.3 24.51,17.91 23.5,16.89 22.75,16.89 22.48,17.16 R8.1
$1N3541: length 3
  Top Layer w0.254: R9.1 20.78,15.06 21.34,15.62 U3.3
$1N3767: length 7.5
  Top Layer w0.254: R12.2 26.8,10.92 26.02,10.14 R11.1 26.8,8.89 27.05,8.64 27.05,7.62 27.69,6.98 U5.2
$1N3921: length 5
  Top Layer w0.254: R13.1 R14.2 26.29,6.73 27.31,5.71 U5.3
$1N4048: length 9.1
  Top Layer w0.3: OUT.5 31.89,16.13 31.59,15.83 31.59,12.48 32.13,11.94 32.88,11.94 R15.2
$1N4065: length 10.8
  Top Layer w0.254: U5.6 34.42,5.71 35.69,6.98 35.69,8.51 34.8,9.4 32.64,9.4 31.89,10.14 R15.1 R12.1

## Copper pours and planes (outline as drawn; the poured copper is in the pictures)
GND on Top Layer: 0,30.73 37.72,30.73 37.72,0 0,0
GND on Bottom Layer: 0,30.73 37.72,30.73 37.72,0 0,0
SIGNAL2 on Top Layer: 14.6,21.84 14.6,19.3 14.73,19.18 17.65,19.18 18.03,18.8 18.67,18.8 18.92,18.54 20.95,18.54 21.08,18.67 21.08,19.86 20.86,20.09 17.91,20.09 16.15,21.84

## Text on the board
Top Silkscreen Layer: Test1 | Test2 | Test4 | Test3 | +5V | ADC驱动电路
